# Altium schematic sheet DataAquisitionSystem.SchDoc
size B
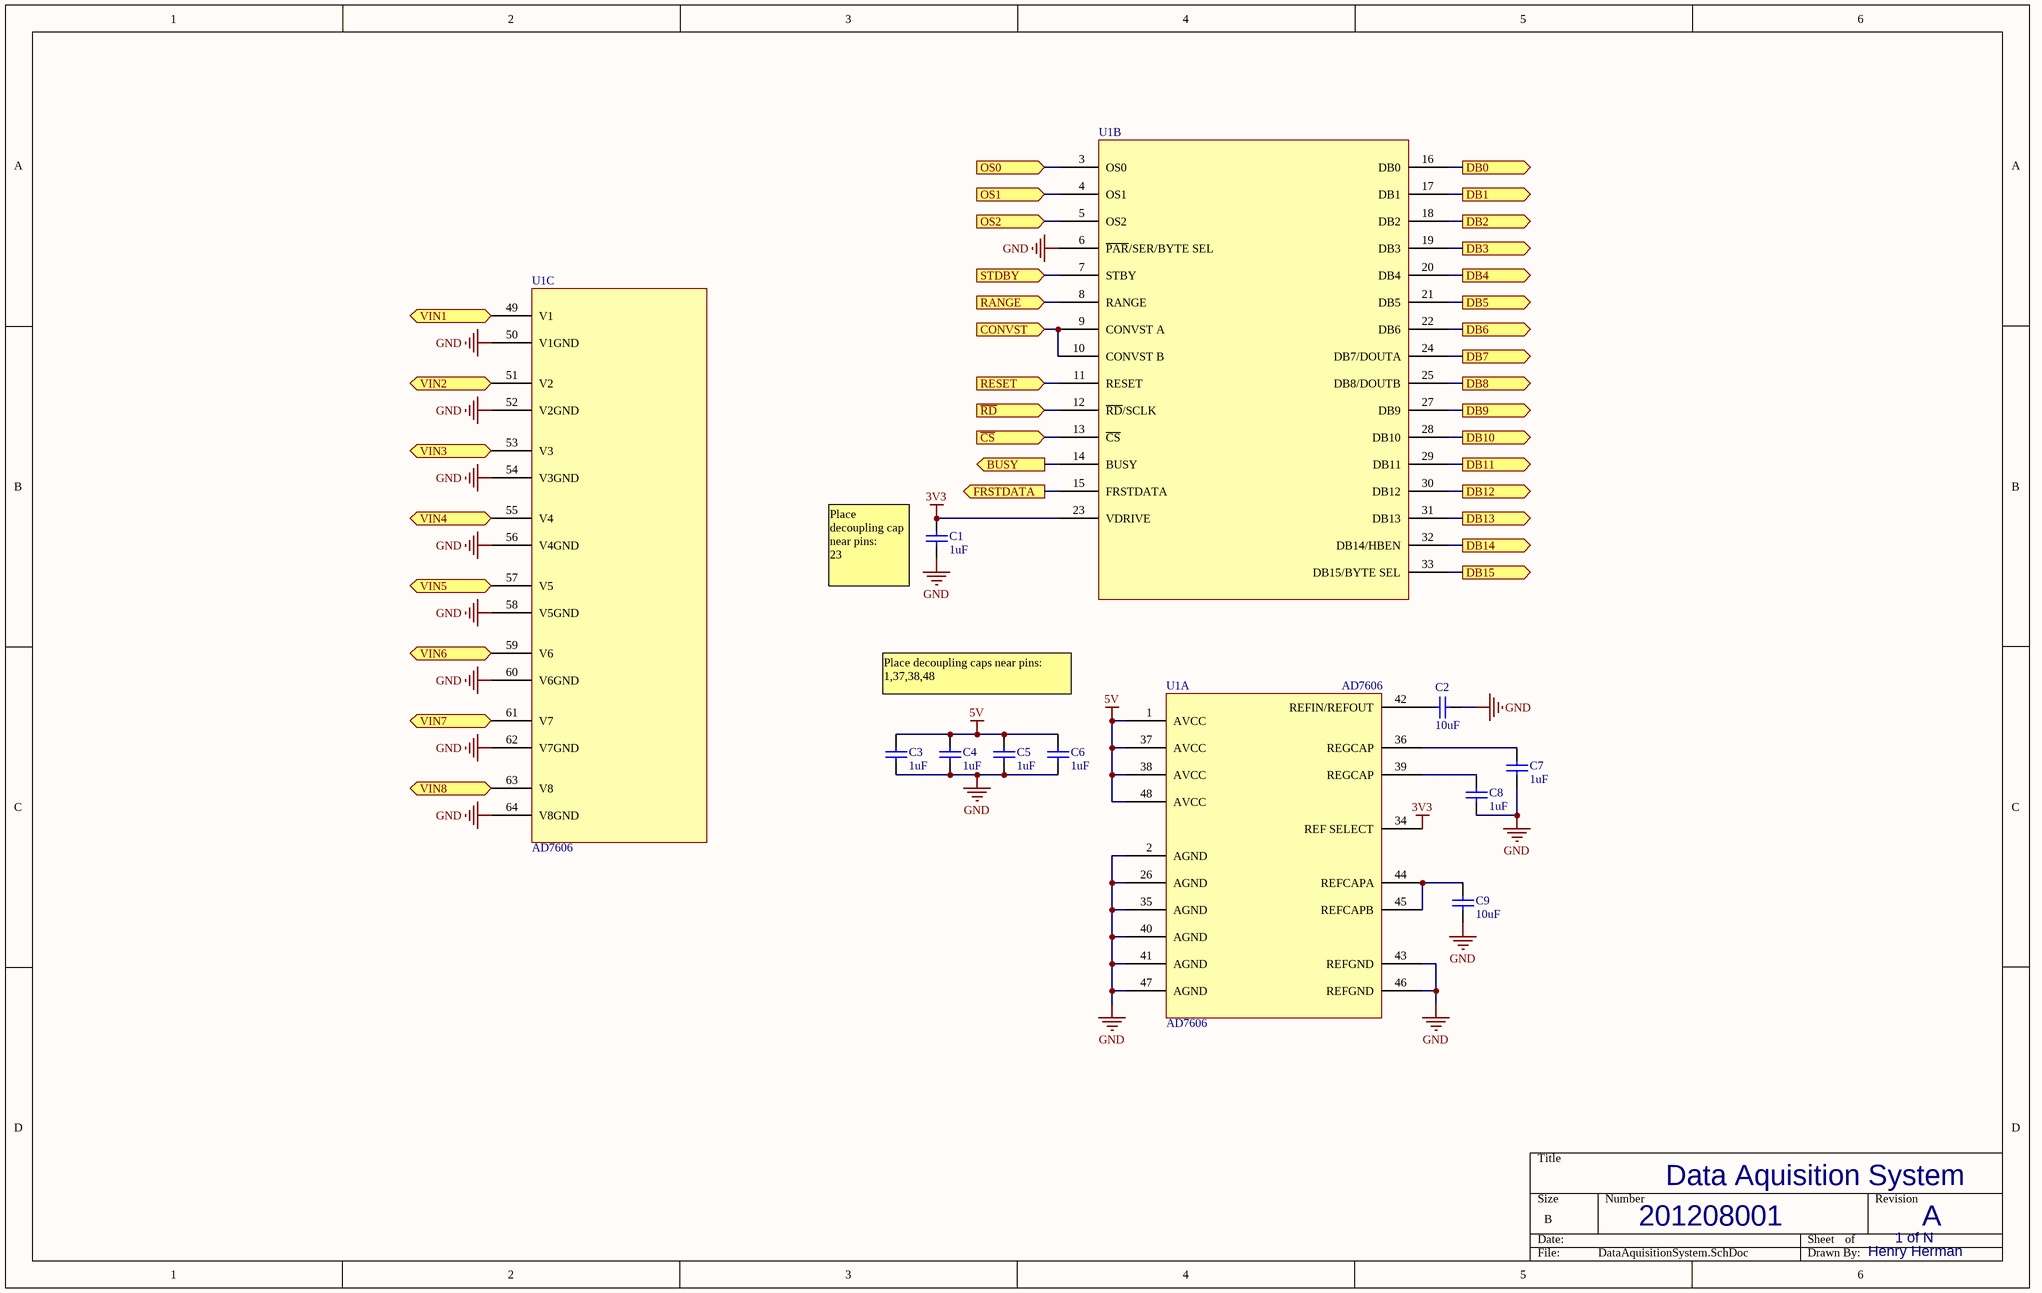
[diagram p0: DataAquisitionSystem.SchDoc]

## Parts
C1  Label: 1uF  [SM/C_0603]  (hidden comment: CAP)
C2  Label: 10uF  [SM/C_0805]  (hidden comment: CAP)
C3  Label: 1uF  [SM/C_0603]  (hidden comment: CAP)
C4  Label: 1uF  [SM/C_0603]  (hidden comment: CAP)
C5  Label: 1uF  [SM/C_0603]  (hidden comment: CAP)
C6  Label: 1uF  [SM/C_0603]  (hidden comment: CAP)
C7  Label: 1uF  [SM/C_0603]  (hidden comment: CAP)
C8  Label: 1uF  [SM/C_0603]  (hidden comment: CAP)
C9  Label: 10uF  [SM/C_0603]  (hidden comment: CAP)
U1  AD7606  [LQFP-64Pins-Analog]  (parts A,B,C of 3)

## Ports
BUSY (out), CONVST (in), DB0 (out), DB1 (out), DB2 (out), DB3 (out), DB4 (out), DB5 (out), DB6 (out), DB7 (out), DB8 (out), DB9 (out), DB10 (out), DB11 (out), DB12 (out), DB13 (out), DB14 (out), DB15 (out), FRSTDATA (out), OS0 (in), OS1 (in), OS2 (in), RANGE (in), RESET (in), STDBY (in), VIN1 (in), VIN2 (in), VIN3 (out), VIN4 (in), VIN5 (in), VIN6 (in), VIN7 (in), VIN8 (in), ~{CS} (in), ~{RD} (in)

## Nets
3V3: C1.2 U1.23(VDRIVE) U1.34(REF_SELECT)
5V: C3.2 C4.2 C5.2 C6.2 U1.1(AVCC) U1.37(AVCC) U1.38(AVCC) U1.48(AVCC)
GND: C1.1 C2.1 C3.1 C4.1 C5.1 C6.1 C7.1 C8.1 C9.1 U1.2(AGND) U1.6(~{PAR}/SER/BYTE_SEL) U1.26(AGND) U1.35(AGND) U1.40(AGND) U1.41(AGND) U1.43(REFGND) U1.46(REFGND) U1.47(AGND) U1.50(V1GND) U1.52(V2GND) U1.54(V3GND) U1.56(V4GND) U1.58(V5GND) U1.60(V6GND) U1.62(V7GND) U1.64(V8GND)
BUSY: U1.14(BUSY) ; port BUSY
~{CS}: U1.13(~{CS}) ; port ~{CS}
CONVST: U1.9(CONVST_A) U1.10(CONVST_B) ; port CONVST
DB0: U1.16(DB0) ; port DB0
DB1: U1.17(DB1) ; port DB1
DB2: U1.18(DB2) ; port DB2
DB3: U1.19(DB3) ; port DB3
DB4: U1.20(DB4) ; port DB4
DB5: U1.21(DB5) ; port DB5
DB6: U1.22(DB6) ; port DB6
DB7: U1.24(DB7/DOUTA) ; port DB7
DB8: U1.25(DB8/DOUTB) ; port DB8
DB9: U1.27(DB9) ; port DB9
DB10: U1.28(DB10) ; port DB10
DB11: U1.29(DB11) ; port DB11
DB12: U1.30(DB12) ; port DB12
DB13: U1.31(DB13) ; port DB13
DB14: U1.32(DB14/HBEN) ; port DB14
DB15: U1.33(DB15/BYTE_SEL) ; port DB15
FRSTDATA: U1.15(FRSTDATA) ; port FRSTDATA
OS0: U1.3(OS0) ; port OS0
OS1: U1.4(OS1) ; port OS1
OS2: U1.5(OS2) ; port OS2
~{RD}: U1.12(~{RD}/SCLK) ; port ~{RD}
RANGE: U1.8(RANGE) ; port RANGE
RESET: U1.11(RESET) ; port RESET
STDBY: U1.7(STBY) ; port STDBY
VIN1: U1.49(V1) ; port VIN1
VIN2: U1.51(V2) ; port VIN2
VIN3: U1.53(V3) ; port VIN3
VIN4: U1.55(V4) ; port VIN4
VIN5: U1.57(V5) ; port VIN5
VIN6: U1.59(V6) ; port VIN6
VIN7: U1.61(V7) ; port VIN7
VIN8: U1.63(V8) ; port VIN8
NetC2_2: C2.2 U1.42(REFIN/REFOUT)
NetC7_2: C7.2 U1.36(REGCAP)
NetC8_2: C8.2 U1.39(REGCAP)
NetC9_2: C9.2 U1.44(REFCAPA) U1.45(REFCAPB)

## Notes on the sheet
- (near C1) Place decoupling cap near pins:
  23
- Place decoupling caps near pins:
  1,37,38,48
- 201208001
- Data Aquisition System
- 1 of N
- A
- Henry Herman

## Library data of the parts
C1 C3-C8 = CAP: Value: 1uF
C2 C9 = CAP: Value: 10uF